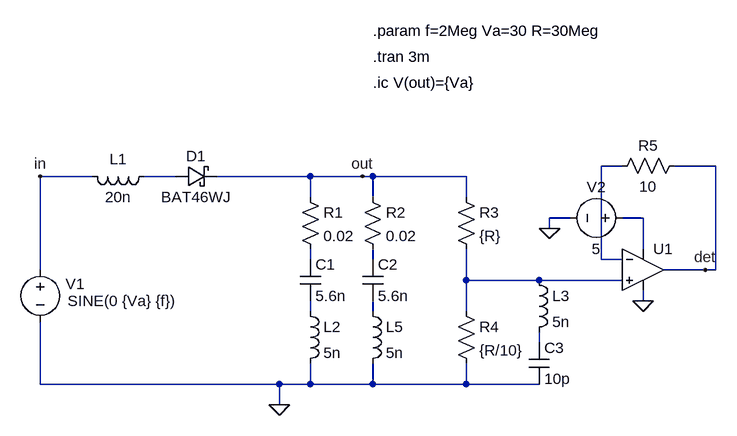
[diagram p0: schematic peak_detector_with_buffer.asc]
peak_detector_with_buffer.asc, the LTspice schematic file:
Version 4
SHEET 1 1120 680
WIRE 784 32 752 32
WIRE 928 32 864 32
WIRE -32 48 -112 48
WIRE 96 48 48 48
WIRE 304 48 160 48
WIRE 384 48 304 48
WIRE 400 48 384 48
WIRE 544 48 400 48
WIRE 304 80 304 48
WIRE 400 80 400 48
WIRE 544 80 544 48
WIRE 704 112 672 112
WIRE 816 112 784 112
WIRE 672 128 672 112
WIRE 816 160 816 112
WIRE 304 176 304 160
WIRE 400 176 400 160
WIRE 752 176 752 32
WIRE 784 176 752 176
WIRE -112 192 -112 48
WIRE 912 192 848 192
WIRE 928 192 928 32
WIRE 928 192 912 192
WIRE 544 208 544 160
WIRE 656 208 544 208
WIRE 784 208 656 208
WIRE 816 240 816 224
WIRE 304 256 304 240
WIRE 400 256 400 240
WIRE 544 256 544 208
WIRE 656 304 656 288
WIRE -112 368 -112 272
WIRE 256 368 -112 368
WIRE 304 368 304 336
WIRE 304 368 256 368
WIRE 400 368 400 336
WIRE 400 368 304 368
WIRE 544 368 544 336
WIRE 544 368 400 368
WIRE 656 368 544 368
WIRE 256 400 256 368
FLAG 384 48 out
FLAG -112 48 in
FLAG 256 400 0
FLAG 816 240 0
FLAG 672 128 0
FLAG 912 192 det
SYMBOL cap 288 176 R0
SYMATTR InstName C1
SYMATTR Value 5.6n
SYMBOL schottky 96 64 R270
WINDOW 0 32 32 VTop 2
WINDOW 3 0 32 VBottom 2
SYMATTR InstName D1
SYMATTR Value BAT46WJ
SYMATTR Description Diode
SYMATTR Type diode
SYMBOL voltage -112 176 R0
WINDOW 3 42 64 Left 2
WINDOW 123 24 124 Left 2
WINDOW 39 0 0 Left 0
WINDOW 0 39 38 Left 2
SYMATTR Value SINE(0 {Va} {f})
SYMATTR InstName V1
SYMBOL ind 64 32 R90
WINDOW 0 5 56 VBottom 2
WINDOW 3 32 56 VTop 2
SYMATTR InstName L1
SYMATTR Value 20n
SYMBOL ind 288 240 R0
SYMATTR InstName L2
SYMATTR Value 5n
SYMBOL cap 384 176 R0
SYMATTR InstName C2
SYMATTR Value 5.6n
SYMBOL ind 384 240 R0
SYMATTR InstName L5
SYMATTR Value 5n
SYMBOL res 288 64 R0
SYMATTR InstName R1
SYMATTR Value 0.02
SYMBOL res 384 64 R0
SYMATTR InstName R2
SYMATTR Value 0.02
SYMBOL res 528 64 R0
SYMATTR InstName R3
SYMATTR Value {R}
SYMBOL res 528 240 R0
SYMATTR InstName R4
SYMATTR Value {R/10}
SYMBOL cap 640 304 R0
SYMATTR InstName C3
SYMATTR Value 10p
SYMBOL Opamps\\UniversalOpamp2 816 192 R0
SYMATTR InstName U1
SYMBOL res 880 16 R90
WINDOW 0 0 56 VBottom 2
WINDOW 3 32 56 VTop 2
SYMATTR InstName R5
SYMATTR Value 10
SYMBOL voltage 800 112 R90
WINDOW 0 -32 56 VBottom 2
WINDOW 3 32 56 VTop 2
SYMATTR InstName V2
SYMATTR Value 5
SYMBOL ind 640 192 R0
SYMATTR InstName L3
SYMATTR Value 5n
TEXT 400 -176 Left 2 !.param f=2Meg Va=30 R=30Meg
TEXT 400 -136 Left 2 !.tran 3m
TEXT 400 -96 Left 2 !.ic V(out)={Va}

The netlist it stands for:
* peak_detector_with_buffer.asc
C1 N004 N007 5.6n
D1 N002 out BAT46WJ
V1 in 0 SINE(0 {Va} {f})
L1 N002 in 20n
L2 N007 0 5n
C2 N005 N008 5.6n
L5 N008 0 5n
R1 out N004 0.02
R2 out N005 0.02
R3 out N006 {R}
R4 N006 0 {R/10}
C3 N009 0 10p
XU1 N006 N001 N003 0 det level.2 Avol=1Meg GBW=10Meg Slew=10Meg ilimit=25m rail=0 Vos=0 phimargin=45 en=0 enk=0 in=0 ink=0 Rin=500Meg  ; pins IN+ IN- V+ V- OUT
R5 det N001 10
V2 N003 0 5
L3 N006 N009 5n
.model D D
.lib standard.dio
.param f=2Meg Va=30 R=30Meg
.tran 3m
.ic V(out)={Va}
.lib UniversalOpamps2.sub
.backanno
.end